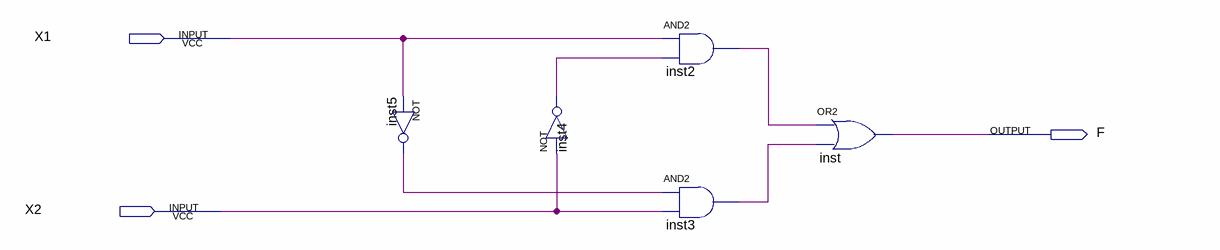
[diagram p0: schematic sheet]
// Quartus schematic lights.bdf as structural Verilog: 5 symbols, 3 pins
module lights (
  input  X1,
  input  X2,
  output F
);

  wire inst2_out, inst3_out, inst4_out, inst5_out;

  not inst5 (inst5_out, X1);
  not inst4 (inst4_out, X2);
  and inst2 (inst2_out, X1, inst4_out);
  and inst3 (inst3_out, inst5_out, X2);
  or inst (F, inst2_out, inst3_out);
endmodule
